# EAGLE schematic TIA Schematic 19 Jan 2017 (EAGLE 6.6.0)
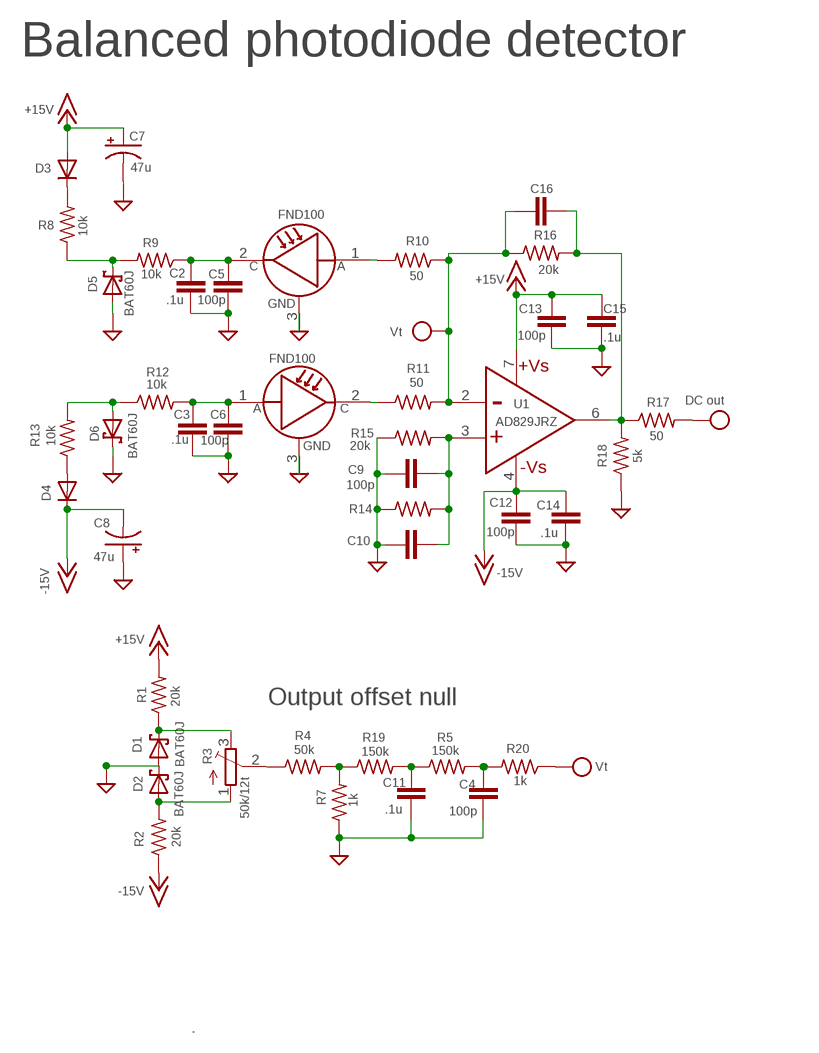
[diagram p0: schematic, sheet 1]

## Parts
C2  .1u  C-EUC0603  [C0603]
C3  .1u  C-EUC0603  [C0603]
C4  100p  C-EUC0603  [C0603]
C5  100p  C-EUC0603  [C0603]
C6  100p  C-EUC0603  [C0603]
C7  47u  CPOL-USETR3  [ETR3]
C8  47u  CPOL-USETR3  [ETR3]
C9  100p  C-EUC0603  [C0603]
C10  C-EUC0603  [C0603]
C11  .1u  C-EUC0603  [C0603]
C12  100p  C-EUC0603  [C0603]
C13  100p  C-EUC0603  [C0603]
C14  .1u  C-EUC0603  [C0603]
C15  .1u  C-EUC0603  [C0603]
C16  C-EUC0603  [C0603]
D1  BAT60J  [SOD323_ST]
D2  BAT60J  [SOD323_ST]
D3  SOD523DIODE  [SOD523]
D4  SOD523DIODE  [SOD523]
D5  BAT60J  [SOD323_ST]
D6  BAT60J  [SOD323_ST]
R1  20k  R-US_R0603  [R0603]
R2  20k  R-US_R0603  [R0603]
R3  50k/12t  TRIM_EU-3223G  [3223G]
R4  50k  R-US_R0603  [R0603]
R5  150k  R-US_R0603  [R0603]
R7  1k  R-US_R0603  [R0603]
R8  10k  R-US_R0603  [R0603]
R9  10k  R-US_R0603  [R0603]
R10  50  R-US_R0603  [R0603]
R11  50  R-US_R0603  [R0603]
R12  10k  R-US_R0603  [R0603]
R13  10k  R-US_R0603  [R0603]
R14  R-US_R0603  [R0603]
R15  20k  R-US_R0603  [R0603]
R16  20k  R-US_R0603  [R0603]
R17  50  R-US_R0603  [R0603]
R18  5k  R-US_R0603  [R0603]
R19  150k  R-US_R0603  [R0603]
R20  1k  R-US_R0603  [R0603]
U1  AD829JRZ  [SOIC127P600X175-8N]
U$1  FND100  [TO254P939X470-3P]
U$2  FND100  [TO254P939X470-3P]

## Nets
+15V: C7.+ C13.2 C15.2 D3.A R1.2 U1.7(+VS)
-15V: C8.- C12.2 C14.2 D4.C R2.1 U1.4(-VS)
GND: C2.1 C3.1 C4.1 C5.1 C6.1 C7.- C8.+ C9.1 C10.1 C11.1 C12.1 C13.1 C14.1 C15.1 D1.A D2.C D5.A D6.C R7.1 R14.1 R15.1 R18.1 U$1.3(GND) U$2.3(GND)
N$1: D3.C R8.2
N$2: R3.2(S) R4.1
N$3: C16.2 R16.2 R17.1 R18.2 U1.6(OUTPUT)
N$4: C4.2 R5.2 R20.2
N$5: C2.2 C5.2 R9.1 U$1.2(C)
N$6: D1.C R1.1 R3.3(E)
N$8: D5.C R8.1 R9.2
N$9: R10.2 U$1.1(A)
N$10: R11.1 U$2.2(C)
N$11: C3.2 C6.2 R12.2 U$2.1(A)
N$12: D6.A R12.1 R13.2
N$13: D4.A R13.1
N$15: R4.2 R7.2 R19.1
N$16: C11.2 R5.1 R19.2
N$17: D2.A R2.2 R3.1(A)
N$18: C9.2 C10.2 R14.2 R15.2 U1.3(+IN)
VPP: C16.1 R10.1 R11.2 R16.1 R20.1 U1.2(-IN)
VSS: R17.2

## Notes on the sheet
- Balanced photodiode detector
- FND100
- Vt
- FND100
- DC out
- Output offset null
- Vt

## Library data of the parts
C2-C6 C9-C16 = rcl:C-EU: CAPACITOR, European symbol
C7 C8 = rcl:CPOL-US: POLARIZED CAPACITOR, American symbol
D1 D2 D5 D6 = diode:BAT60J: Schottky barrier diode Source: www.st.com, BAT60J.pdf
D3 D4 = mylibrary:SOD523DIODE
R1 R2 R4 R5 R7-R20 = rcl:R-US_: RESISTOR, American symbol
R3 = pot:TRIM_EU-: POTENTIOMETER
U1 = mylibrary:AD829JRZ: High Speed, Low Noise Video Op Amp; MPN: AD829JRZ; OC_FARNELL: 1651321; OC_NEWARK: 19M8894; PACKAGE: SOIC-8; SUPPLIER: Analog Devices
U$1 U$2 = mylibrary:FND100